# EAGLE design Schematic_start_module_sumo_IR_V0_17 (EAGLE 6.3)
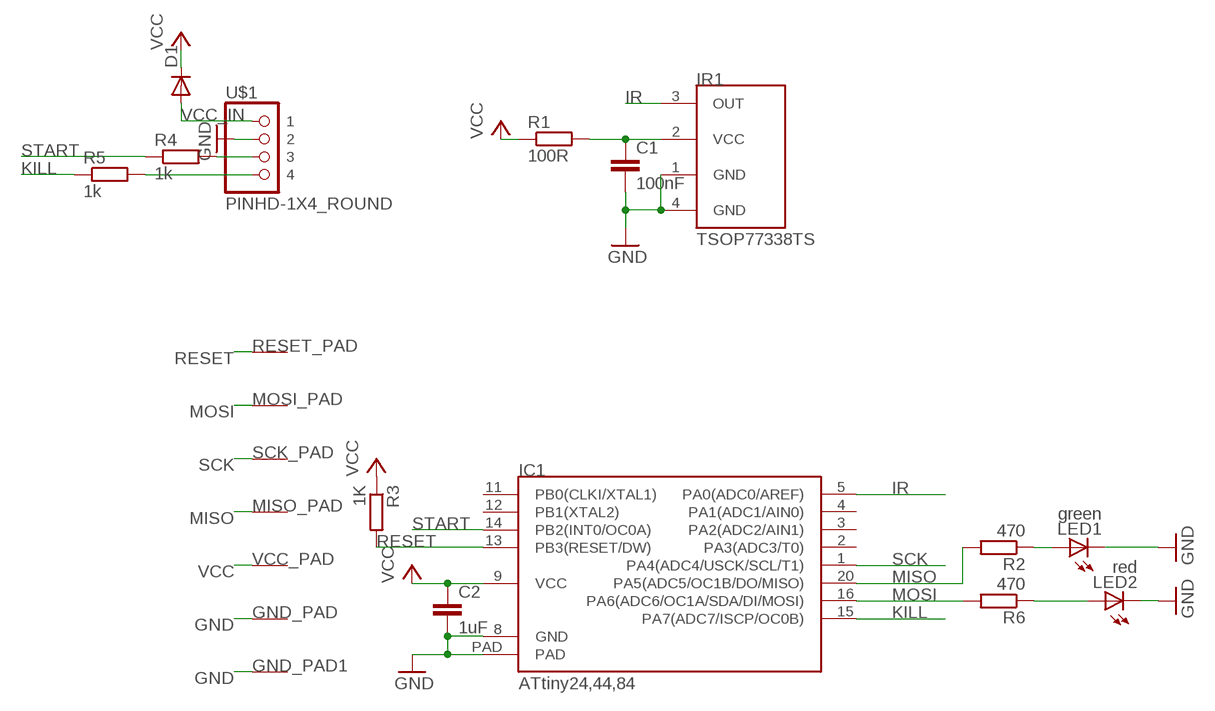
[diagram p0: schematic, sheet 1]

## Parts
C1  100nF  C-EUC0603  [C0603]
C2  1uF  C-EUC0603  [C0603]
D1  DIODE-SOD523  [SOD523]
GND_PAD  PAD50X50  [PAD_50X50]
GND_PAD1  PAD75X75  [PAD_75X75]
IC1  ATTINY24,44,84_QFNVQFN  [VQFN20]
IR1  TSOP77338TS  [TSOP77338]
LED1  green  LED0603  [0603_SMALL]
LED2  red  LED0603  [0603_SMALL]
MISO_PAD  PAD50X50  [PAD_50X50]
MOSI_PAD  PAD50X50  [PAD_50X50]
R1  100R  R-EU_R0402  [R0402]
R2  470  R-EU_R0402  [R0402]
R3  1K  R-EU_R0402  [R0402]
R4  1k  R-EU_R0402  [R0402]
R5  1k  R-EU_R0402  [R0402]
R6  470  R-EU_R0402  [R0402]
RESET_PAD  PAD50X50  [PAD_50X50]
SCK_PAD  mosi  PAD75X75  [PAD_75X75]
U$1  PINHD-1X4_ROUND  [1X04_ROUND]
VCC_PAD  PAD50X50  [PAD_50X50]

## Nets
GND: C1.2 C2.2 GND_PAD1.P$1(PAD) GND_PAD.P$1(PAD) IC1.8(GND) IC1.PAD IR1.1(GND) IR1.4(GND) LED1.2(C) LED2.2(C) U$1.2
IR: IC1.5(PA0(ADC0/AREF)) IR1.3(OUT)
KILL: IC1.15(PA7(ADC7/ISCP/OC0B)) R5.1
MISO: IC1.20(PA5(ADC5/OC1B/DO/MISO)) MISO_PAD.P$1(PAD) R2.2
MOSI: IC1.16(PA6(ADC6/OC1A/SDA/DI/MOSI)) MOSI_PAD.P$1(PAD) R6.2
N$1: LED2.1(A) R6.1
N$2: C1.1 IR1.2(VCC) R1.2
N$3: LED1.1(A) R2.1
N$4: R5.2 U$1.4
N$5: R4.2 U$1.3
RESET: IC1.13(PB3(RESET/DW)) R3.2 RESET_PAD.P$1(PAD)
SCK: IC1.1(PA4(ADC4/USCK/SCL/T1)) SCK_PAD.P$1(PAD)
START: IC1.14(PB2(INT0/OC0A)) R4.1
VCC: C2.1 D1.C IC1.9(VCC) R1.1 R3.1 VCC_PAD.P$1(PAD)
VCC_IN: D1.A U$1.1
Unconnected: IC1.2(PA3(ADC3/T0)) IC1.3(PA2(ADC2/AIN1)) IC1.4(PA1(ADC1/AIN0)) IC1.11(PB0(CLKI/XTAL1)) IC1.12(PB1(XTAL2))

## Library data of the parts
C1 C2 = rcl:C-EU: CAPACITOR, European symbol
D1 = diode:DIODE-: DIODE
GND_PAD GND_PAD1 MISO_PAD MOSI_PAD RESET_PAD SCK_PAD VCC_PAD = CRF:PAD
IC1 = CRF:ATTINY24,44,84_QFN: ATtiny24,44,84 Small 8-bit microcontroller from Atmel. Available in QFN(MLF)20 and SOIC14. VQFN is available for the A-variant. http://atmel.com/dyn/resources/prod_documents/doc8006.pdf
IR1 = CRF:TSOP77338: Liten IR receiver ytmonterad ca 12kr på Farnell. http://www.vishay.com/docs/83346/tsop773.pdf
LED1 LED2 = CRF:LED: LED
R1-R6 = rcl:R-EU_: RESISTOR, European symbol
U$1 = CRF:PINHD-1X4

## Board
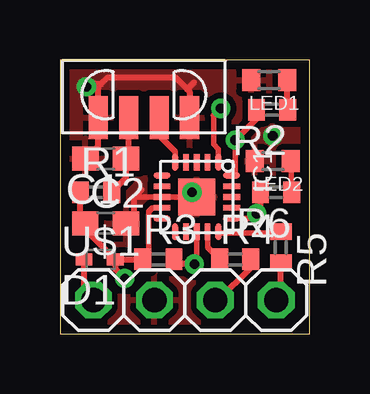
[diagram p1: board, top side]
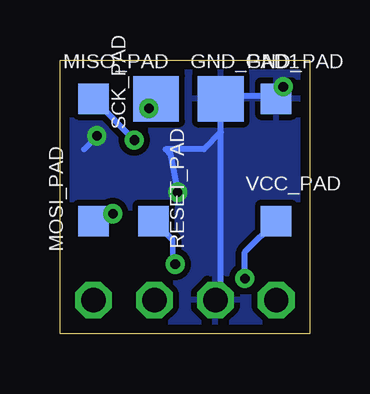
[diagram p2: board, bottom side, seen from below]

Size 10.4 x 11.42 mm. Coordinates in mm from the lower left corner, seen from the top.
Outline: 0,0 10.4,0 10.4,11.42 0,11.42 0,0
Copper layers (1*16): Top 0.0356mm / dielectric 1.5011mm / Bottom 0.0356mm
Design rules "LaenPCBOrder *": minimum track width 6mil, minimum drill 13mil, track to track 0.25mm, track to pad 0.25mm, pad to pad 0.25mm, via to via 0.25mm, smd to smd 0mil, copper to edge 15mil, drill to drill 6mil, minimum pad ring 7mil, minimum via ring 7mil, stop-mask expansion 4mil, vias tented up to drill 0.5mm, thermal gap 10mil

### Footprints (pad centres in the part's own frame; a part is rotated, then mirrored left to right if it is on the bottom)
C0603 = smd 1.1 x 1: 1 -0.85,0; 2 0.85,0
SOD523 = smd 0.7 x 0.5: A 0.7,0; C -0.6,0
PAD_50X50 = smd 1.27 x 1.27: P$1 0,0
PAD_75X75 = smd 1.905 x 1.905: P$1 0,0
VQFN20 = smd 0.7 x 0.24: 1 -1.45,0.9; 2 -1.45,0.45; 3 -1.45,0; 4 -1.45,-0.45; 5 -1.45,-0.9; 11 1.45,-0.9; 12 1.45,-0.45; 13 1.45,0; 14 1.45,0.45; 15 1.45,0.9 | smd 0.24 x 0.7: 6 -0.9,-1.45; 7 -0.45,-1.45; 8 0,-1.45; 9 0.45,-1.45; 10 0.9,-1.45; 16 0.9,1.45; 17 0.45,1.45; 18 0,1.45; 19 -0.45,1.45; 20 -0.9,1.45 | smd 1.55 x 1.55: PAD 0,0
TSOP77338 = smd 0.8 x 1.8: 1 -1.905,0.635; 2 -0.633,0.635; 3 0.637,0.635; 4 1.905,0.635
0603_SMALL = smd 0.75 x 0.9: 1 -0.75,0; 2 0.75,0
R0402 = smd 0.7 x 0.9: 1 -0.65,0; 2 0.65,0
1X04_ROUND = drill 1.016 octagon: 1 -3.81,0; 2 -1.27,0; 3 1.27,0; 4 3.81,0

### Placement (x,y rotation side)
C1  1.91,7.3 180 top
C2  1.9,4.6 0 top
D1  1.7,3.1 180 top
GND_PAD  1.4,9.8 0 bottom
GND_PAD1  3.7,9.8 0 bottom
IC1  5.7,5.7 270 top
IR1  3.49,8.38 0 top
LED1  8.71,10.58 180 top
LED2  8.87,7.2 180 top
MISO_PAD  9,9.8 0 bottom
MOSI_PAD  9,4.7 90 bottom
R1  1.5,5.9 0 top
R2  8.84,9.34 180 top
R3  4.1,3.1 0 top
R4  7.3,3.1 0 top
R5  9.2,3.6 270 top
R6  9,5.9 180 top
RESET_PAD  6.5,4.7 180 bottom
SCK_PAD  6.4,9.8 90 bottom
U$1  5.2,1.4 0 top
VCC_PAD  1.4,4.7 0 bottom

### Tracks (layer width: path | path; a pad name or v marks a point on that pad's centre or on a via)
GND  (via drill 0.4 pad 0.8)
  Top 0.23: 3.1,5.7 IC1.8 5.3,5.7 v5.5,5.9
  Top 0.25: C2.2 3.1,4.95 3.1,5.7 3.4,6 | 1.7,10.4 1.59,10.29 IR1.1 1.59,7.83 C1.2 0.8,7.56 | 1.7,10.4 2,10.7 4.8,10.7 5.3,10.2 | 5.3,10.2 5.4,10.1 IR1.4 | 5.58,10.48 5.3,10.2 | 1.7,10.4 1.2,10.4 v1.1,10.3
  Bottom 0.25: U$1.2 3.7,1.63 3.7,8.4 | 3.7,8.4 GND_PAD1.P$1 3.8,9.8 3.9,9.9 1.5,9.9 | GND_PAD.P$1 1.5,9.9 | 3.7,8.4 4.4,7.7 6,7.7 5.8,7.5 v5.5,5.9 | 9.4,7.7 v8.87,8.25 | 1.5,9.9 v1.1,10.3
  pour Bottom (isolate 0.25): -0.6,11.7 11,11.7 11,-0.4 -0.6,-0.4
  pour Top (isolate 0.25): -0.8,12.2 11.4,12.2 11.4,-0.7 -0.8,-0.7
IR
  Top 0.23: 4.13,8.27 4.8,7.6 IC1.5
  Top 0.25: 4.13,8.27 IR1.3
KILL
  Top 0.23: 6.65,4.2 8.95,4.2
  Top 0.25: R5.1 8.95,4.2 | IC1.15 6.65,4.2
MISO  (via drill 0.4 pad 0.8)
  Top 0.23: IC1.20 7.3,6.75 v7.3,8.07
  Top 0.25: R2.2 8,9.13 | R2.2 8.2,9.13 | R2.2 8.19,8.96 v7.3,8.07
  Bottom 0.25: MISO_PAD.P$1 8.9,9.8 8.9,9.67 v7.3,8.07
MOSI  (via drill 0.4 pad 0.8)
  Top 0.23: IC1.16 8,4.8
  Top 0.25: 8.3,5.95 R6.2 8.35,5.15 v8.2,5 8,4.8
  Bottom 0.25: MOSI_PAD.P$1 8.5,4.7 v8.2,5
N$1
  Top 0.23: R6.1 LED2.1
N$2
  Top 0.25: R1.2 2.75,6.5 C1.1 2.86,7.41 IR1.2
N$3
  Top 0.25: 9.29,10.45 LED1.1 9.46,9.17 R2.1
N$4
  Top 0.25: U$1.4 9.2,1.59 R5.2
N$5
  Top 0.25: U$1.3 6.6,1.4 7.95,2.75 R4.2
RESET  (via drill 0.4 pad 0.8)
  Top 0.23: IC1.13 5.7,3
  Top 0.25: 4.75,3.35 R3.2 | R3.2 4.95,2.9 v5.6,2.9 5.7,3 | 4.8,3.1 R3.2
  Bottom 0.23: v5.6,2.9 5.7,3 5.7,3.9 RESET_PAD.P$1
SCK  (via drill 0.4 pad 0.8)
  Top 0.23: IC1.1 6.6,7.7 6.4,7.9 6.4,9.1
  Top 0.25: 6.4,9.1 v6.7,9.4
  Bottom 0.25: SCK_PAD.P$1 v6.7,9.4
START
  Top 0.23: R4.1 6.15,3.6 IC1.14
VCC  (via drill 0.4 pad 0.8)
  Top 0.23: IC1.9 3.85,5.25 3.7,5.1 3.7,3.35
  Top 0.25: D1.C R3.1 3.7,3.35 | D1.C 1.05,4.35 C2.1 0.85,4.8 R1.1 | D1.C 2.3,2.7 v2.7,2.3
  Bottom 0.25: VCC_PAD.P$1 2.7,3.4 v2.7,2.3
VCC_IN
  Top 0.25: U$1.1 1,1.79 D1.A

### Text on the board
tTest: V0.16
bTest: GND | HOME | VCC | GND | Start | Kill